# Altium schematic sheet Sheet_1_2022-01-04.schdoc
size 64 x 45 mm
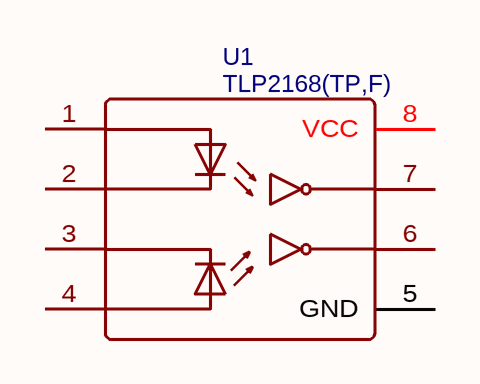
[diagram p0: Sheet_1_2022-01-04.schdoc]

## Parts
U1  TLP2168(TP,F)  [SO-8_L4.9-W3.9-P1.27-LS5.9-BL]

## Nets

Not connected (* = marked no-connect by the designer): U1 1(AN1) 2(CAT1) 3(CAT2) 4(AN2) 5(GND) 6(VO2) 7(VO1) 8(VCC)

## Library data of the parts
U1 = TLP2168(TP,F): BOM_Manufacturer: TOSHIBA; Contributor: LCSC; BOM_Supplier: LCSC; BOM_Supplier Part: C99480; BOM_Manufacturer Part: TLP2168(TP,F); BOM_JLCPCB Part Class: Extended Part; spicePre: U; spiceSymbolName: TLP2168(TP,F)